# EAGLE schematic board (EAGLE 6.4)
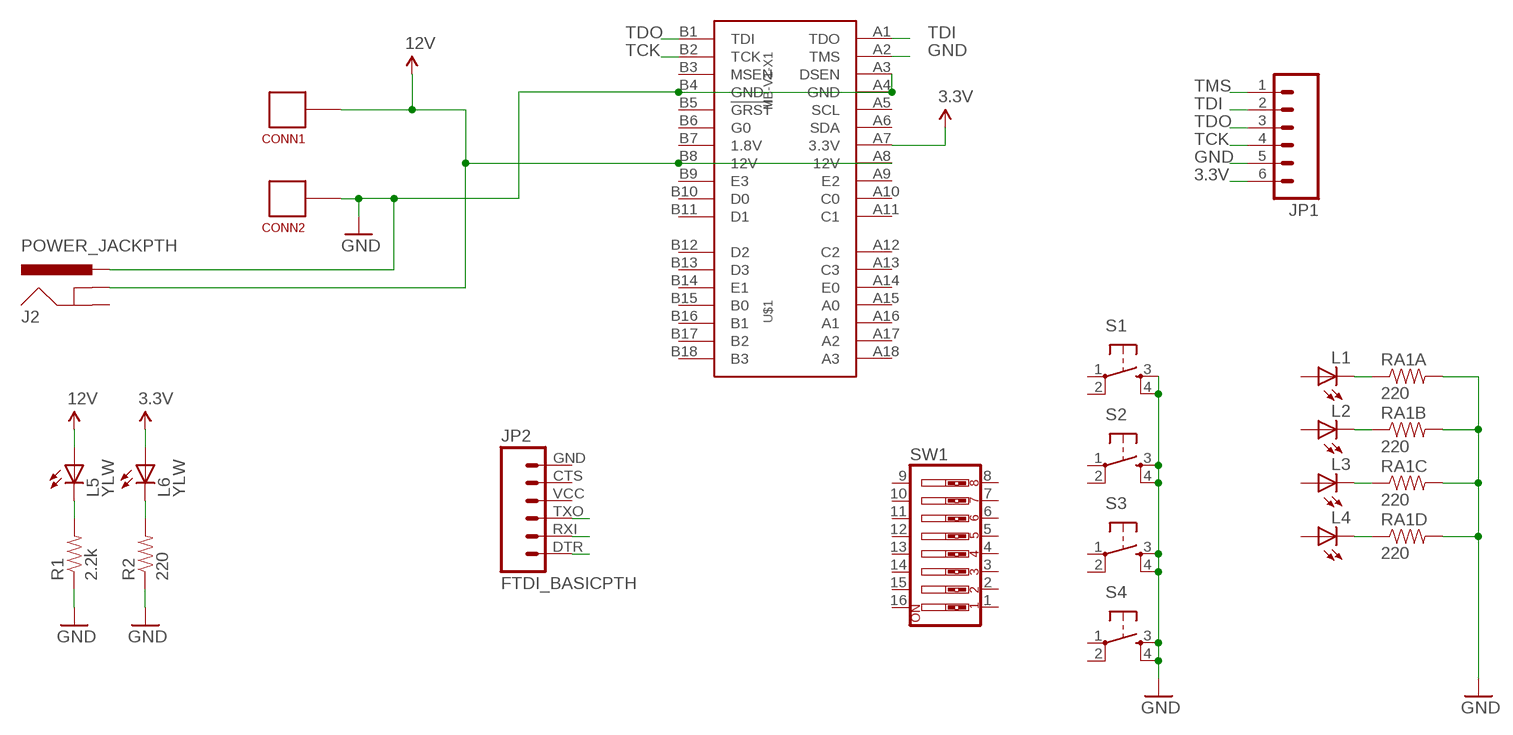
[diagram p0: schematic, sheet 1]

## Parts
CONN1  CONNECTOR18AWG  [HOLE_18AWG]
CONN2  CONNECTOR18AWG  [HOLE_18AWG]
J2  POWER_JACKPTH  [POWER_JACK_PTH]
JP1  M06LOCK  [1X06_LOCK]
JP2  FTDI_BASICPTH  [FTDI_BASIC]
L1  LED0603  [0603_LED]
L2  LED0603  [0603_LED]
L3  LED0603  [0603_LED]
L4  LED0603  [0603_LED]
L5  YLW  LED0603  [0603_LED]
L6  YLW  LED0603  [0603_LED]
R1  2.2k  RESISTOR0603  [0603-RES]
R2  220  RESISTOR0603  [0603-RES]
RA1  220  RESISTOR_ARRAY0603_X4  [0603-ARV]
S1  TAC_SWITCHPTH  [TACTILE-PTH]
S2  TAC_SWITCHPTH  [TACTILE-PTH]
S3  TAC_SWITCHPTH  [TACTILE-PTH]
S4  TAC_SWITCHPTH  [TACTILE-PTH]
SW1  SW_DIP-8  [DIPSWITCH-08]
U$1  MB-V1-X1  [PCIE-X1-EDGE]

## Nets
3.3V: JP1.6 L6.A U$1.A7(3.3V)
12V: CONN1.P$1(P) J2.GNDBREAK L5.A U$1.A8(12V) U$1.B8(12V)
GND: CONN2.P$1(P) J2.PWR JP1.5 R1.1 R2.1 RA1.5 RA1.6 RA1.7 RA1.8 S1.3 S1.4 S2.3 S2.4 S3.3 S3.4 S4.3 S4.4 U$1.A2(TMS) U$1.A3(DSEN) U$1.A4(GND) U$1.B4(GND)
N$1: L5.C R1.2
N$2: L1.C RA1.1
N$3: L2.C RA1.2
N$4: L3.C RA1.3
N$5: L4.C RA1.4
N$6: L6.C R2.2
N$9: JP2.TXO
N$10: JP2.RXI
N$11: JP2.DTR
TCK: JP1.4 U$1.B2(TCK)
TDI: JP1.2 U$1.A1(TDO)
TDO: JP1.3 U$1.B1(TDI)
TMS: JP1.1
Unconnected: J2.GND JP2.CTS JP2.GND JP2.VCC L1.A L2.A L3.A L4.A S1.1 S1.2 S2.1 S2.2 S3.1 S3.2 S4.1 S4.2 SW1.1 SW1.2 SW1.3 SW1.4 SW1.5 SW1.6 SW1.7 SW1.8 SW1.9 SW1.10 SW1.11 SW1.12 SW1.13 SW1.14 SW1.15 SW1.16 U$1.A5(SCL) U$1.A6(SDA) U$1.A9(E2) U$1.A10(C0) U$1.A11(C1) U$1.A12(C2) U$1.A13(C3) U$1.A14(E0) U$1.A15(A0) U$1.A16(A1) U$1.A17(A2) U$1.A18(A3) U$1.B3(MSEN) U$1.B5(!GRST) U$1.B6(G0) U$1.B7(1.8V) U$1.B9(E3) U$1.B10(D0) U$1.B11(D1) U$1.B12(D2) U$1.B13(D3) U$1.B14(E1) U$1.B15(B0) U$1.B16(B1) U$1.B17(B2) U$1.B18(B3)

## Library data of the parts
CONN1 CONN2 = kmod-nonparts:CONNECTOR: Collection of holes/pads for testing/connecting
J2 = SparkFun-Connectors:POWER_JACK: Power Jack This is the standard 5.5mm barrel jack for power. The PTH is the most common, proven, reliable, footprint. The Slot footprint only works if the mill layer is transmitted to the PCB fab house so be warned. Spark Fun Electronics SKU : PRT-00119 SMT: CONN-08106 Mating wall wart : TOL-00298 (and others)
JP1 = SparkFun-Connectors:M06: Header 6 Standard 6-pin 0.1" header. Use with straight break away headers (SKU : PRT-00116), right angle break away headers (PRT-00553), swiss pins (PRT-00743), machine pins (PRT-00117), and female headers (PRT-00115). Molex polarized connector foot print use with SKU : PRT-08094 with associated crimp pins and housings. NOTES ON THE VARIANTS LOCK and LOCK_LONGPADS... This footprint was designed to help hold the alignment of a through-hole component (i.e. 6-pin header) while soldering it into place. You may notice that each hole has been shifted either up or down by 0.005 of an inch from it's more standard position (which is a perfectly straight line). This slight alteration caused the pins (the squares in the middle) to touch the edges of the holes. Because they are alternating, it causes a "brace" to hold the component in place. 0.005 has proven to be the perfect amount of "off-center" position when using our standard breakaway headers. Although looks a little odd when you look at the bare footprint, once you have a header in there, the alteration is very hard to notice. Also,if you push a header all the way into place, it is covered up entirely on the bottom side. This idea of altering the position of holes to aid alignment will be further integrated into the Sparkfun Library for other footprints. It can help hold any component with 3 or more connection pins.
JP2 = SparkFun-Connectors:FTDI_BASIC: FTDI Basic header with labels
L1-L6 = kmod-passives:LED
R1 R2 = kmod-passives:RESISTOR: Resistor Basic schematic elements and footprints for 0603, 1206, and PTH resistors.
RA1 = kmod-passives:RESISTOR_ARRAY
S1-S4 = kmod-mechanical:TAC_SWITCH: Momentary Switch Button commonly used for reset or general input. Spark Fun Electronics SKU : COM-00097 SMT- SWCH-08247
SW1 = SparkFun-Electromechanical:SW_DIP-8: DIP Switch 8 Position Spark Fun Electronics SKU : COM-08034
U$1 = kmod-connectors:MB-V1-X1